# Altium schematic sheet Sheet4.SchDoc
size A3
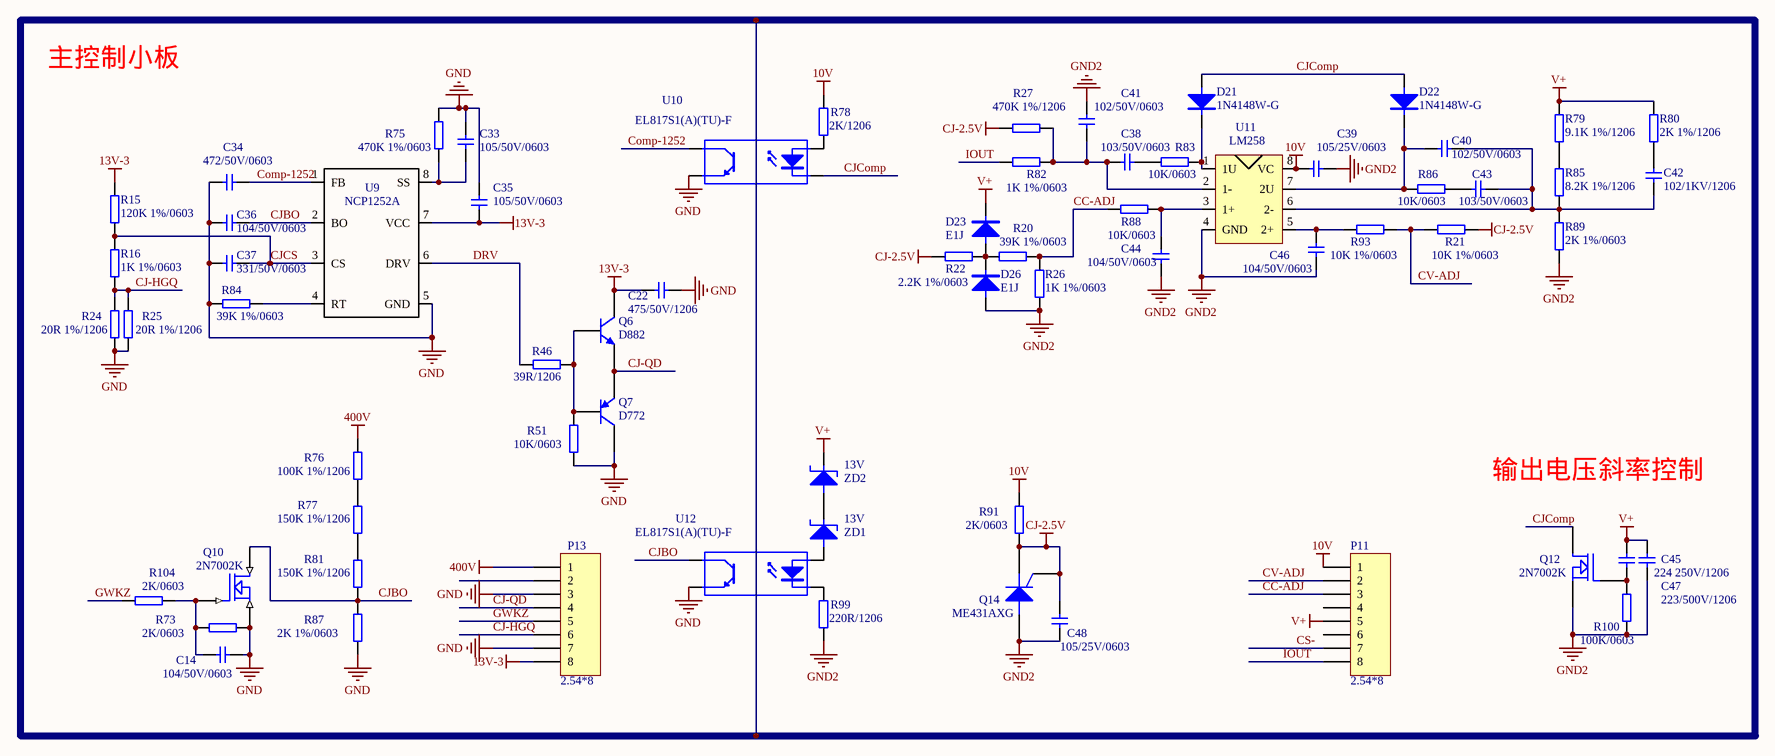
[diagram p0: Sheet4.SchDoc]

## Parts
C14  104/50V/0603  [0603]
C22  475/50V/1206  [1206]
C33  105/50V/0603  [0603]
C34  472/50V/0603  [0603]
C35  105/50V/0603  [0603]
C36  104/50V/0603  [0603]
C37  331/50V/0603  [0603]
C38  103/50V/0603  [0603]
C39  105/25V/0603  [0603]
C40  102/50V/0603  [0603]
C41  102/50V/0603  [0603]
C42  102/1KV/1206  [1206]
C43  103/50V/0603  [0603]
C44  104/50V/0603  [0603]
C45  224 250V/1206  [1206]
C46  104/50V/0603  [0603]
C47  223/500V/1206  [1206]
C48  105/25V/0603  [0603]
D21  1N4148W-G  [SOD-123]
D22  1N4148W-G  [SOD-123]
D23  E1J  [SOD-123]
D26  E1J  [SOD-123]
P11  2.54*8  [2.54*8]
P13  2.54*8  [2.54*8]
Q6  D882  [D882]
Q7  D772  [D772]
Q10  2N7002K  [SOT-23/MOS]
Q12  2N7002K  [SOT-23/MOS]
Q14  ME431AXG  [ME431AXG]
R15  120K 1%/0603  [0603]
R16  1K 1%/0603  [0603]
R20  39K 1%/0603  [0603]
R21  10K 1%/0603  [0603]
R22  2.2K 1%/0603  [0603]
R24  20R 1%/1206  [1206]
R25  20R 1%/1206  [1206]
R26  1K 1%/0603  [0603]
R27  470K 1%/1206  [1206]
R46  39R/1206  [1206]
R51  10K/0603  [0603]
R73  2K/0603  [0603]
R75  470K 1%/0603  [0603]
R76  100K 1%/1206  [1206]
R77  150K 1%/1206  [1206]
R78  2K/1206  [1206]
R79  9.1K 1%/1206  [1206]
R80  2K 1%/1206  [1206]
R81  150K 1%/1206  [1206]
R82  1K 1%/0603  [0603]
R83  10K/0603  [0603]
R84  39K 1%/0603  [0603]
R85  8.2K 1%/1206  [1206]
R86  10K/0603  [0603]
R87  2K 1%/0603  [0603]
R88  10K/0603  [0603]
R89  2K 1%/0603  [0603]
R91  2K/0603  [0603]
R93  10K 1%/0603  [0603]
R99  220R/1206  [1206]
R100  100K/0603  [0603]
R104  2K/0603  [0603]
U9  NCP1252A  [SOP8]
U10  EL817S1(A)(TU)-F  [EL817A]
U11  LM258  [SOp8]
U12  EL817S1(A)(TU)-F  [EL817A]
ZD1  13V  [SOD-123]
ZD2  13V  [SOD-123]

## Nets
10V: C39.2 P11.1 R78.2 R91.2 U11.8(VC)
13V-3: C22.2 C35.1 P13.8 Q6.3(C) R15.1 U9.7(VCC)
400V: P13.1 R76.2
CJ-2.5V: C48.2 Q14.2(G) Q14.3(K) R21.2 R22.1 R27.2 R91.1
GND: C14.1 C22.1 C33.2 C34.2 C35.2 C36.2 C37.2 P13.3 P13.7 Q7.3(C) Q10.S R24.2 R25.2 R51.1 R73.1 R75.2 R84.1 R87.2 U9.5(GND) U10.3(E) U12.3(E)
GND2: C39.1 C41.2 C44.1 C45.2 C46.2 C48.1 D26.1(A) Q12.S Q14.1(A) R26.1 R89.1 R99.1 R100.1 U11.4(GND)
V+: C45.1 C47.1 D23.2(K) P11.5 R79.2 R80.2 ZD2.2(K)
CC-ADJ: P11.3 R20.2 R26.2 R88.1
CJ-HGQ: P13.6 R16.2 R24.1 R25.1
CJ-QD: P13.4 Q6.1(E) Q7.1(E)
CJBO: C36.1 Q10.D R81.1 R87.1 U9.2(BO) U12.4(C)
CJComp: D21.1(A) D22.1(A) Q12.D U10.2(K)
CJCS: C37.1 R15.2 R16.1 U9.3(CS)
Comp-1252: C34.1 U9.1(FB) U10.4(C)
CS-: P11.7
CV-ADJ: P11.2 R21.1 R93.2
DRV: R46.2 U9.6(DRV)
GWKZ: P13.5 R104.2
IOUT: P11.8 R82.2
NetC14_2: C14.2 Q10.G R73.2 R104.1
NetC33_1: C33.1 R75.1 U9.8(SS)
NetC38_1: C38.1 R83.1
NetC38_2: C38.2 C41.1 R27.1 R82.1 U11.2(1-)
NetC40_1: C40.1 C42.1 C43.1 R85.1 R89.2 U11.6(2-)
NetC40_2: C40.2 D22.2(K) R86.1 U11.7(2U)
NetC42_2: C42.2 R80.1
NetC43_2: C43.2 R86.2
NetC44_2: C44.2 R88.2 U11.3(1+)
NetC46_1: C46.1 R93.1 U11.5(2+)
NetC47_2: C47.2 Q12.G R100.2
NetD21_2: D21.2(K) R83.2 U11.1(1U)
NetD23_1: D23.1(A) D26.2(K) R20.1 R22.2
NetQ6_2: Q6.2(B) Q7.2(B) R46.1 R51.2
NetR76_1: R76.1 R77.2
NetR77_1: R77.1 R81.2
NetR78_1: R78.1 U10.1(A)
NetR79_1: R79.1 R85.2
NetR84_2: R84.2 U9.4(RT)
NetR99_2: R99.2 U12.2(K)
NetU12_1: U12.1(A) ZD1.1(A)
NetZD1_2: ZD1.2(K) ZD2.1(A)

Not connected (* = marked no-connect by the designer): P11 4 6; P13 2

## Notes on the sheet
- 主控制小板
- 输出电压斜率控制

## Library data of the parts
C14 C22 C33-C48 = CAP: Capacitor
D21-D23 D26 = DIODE
P11 P13 = Header 8: Header, 8-Pin; LatestRevisionDate: 17-Jul-2002; LatestRevisionNote: Re-released for DXP Platform.; Publisher: Altium Limited
Q6 = 2N3904: NPN General Purpose Amplifier; Published: 8-Jun-2000; LatestRevisionDate: 15-Jan-2003; LatestRevisionNote: PCB Footprint 'BCY-W3/D4.7' replaced; DatasheetVersion: 1997; PackageVersion: Sep-1998; PackageReference: TO-92A; Publisher: Altium Limited; Code_JEDEC: TO-92A; ComponentLink1Description: Manufacturer Link; ComponentLink1URL: http://www.fairchildsemi.com/; ComponentLink2Description: Datasheet; ComponentLink2URL: http://www.fairchildsemi.com/ds/2N%2F2N3904.pdf
Q7 = 2N3906: PNP General Purpose Amplifier; Published: 8-Jun-2000; LatestRevisionDate: 15-Jan-2003; LatestRevisionNote: PCB Footprint 'BCY-W3/D4.7' replaced; DatasheetVersion: 1997; PackageVersion: Sep-1998; PackageReference: TO-92A; Publisher: Altium Limited; Code_JEDEC: TO-92A; ComponentLink1Description: Manufacturer Link; ComponentLink1URL: http://www.fairchildsemi.com/; ComponentLink2Description: Datasheet; ComponentLink2URL: http://www.fairchildsemi.com/ds/2N%2F2N3906.pdf
Q10 Q12 = MOSFET N
Q14 = SCR: Silicon Controlled Rectifier; Published: 8-Jun-2000; LatestRevisionDate: 17-Jul-2002; LatestRevisionNote: Re-released for DXP Platform.; PackageReference: TO-220-AB; Publisher: Altium Limited; Code_JEDEC: TO-220-AB
R15 R16 R20-R22 R24-R27 R46 R51 R73 R75-R89 R91 R93 R99 R100 R104 = RES2
U9 = Component_1
U10 U12 = Optoisolator1: 4-Pin Phototransistor Optocoupler; Published: 24-Mar-1999; LatestRevisionDate: 04-Mar-2005; LatestRevisionNote: Sch pins 3 & 4 Swapped.; DatasheetVersion: Nov-2003; PackageReference: DIP-4; Publisher: Altium Limited
U11 = AP4310
ZD1 ZD2 = DIODE TUNNEL